# Altium schematic sheet COMS0011 Communications Footprints.SchDoc: Flatsat Communications Footprints
size A3; Engineer: A. Shaw, E.Nafis, C. Brown; DocumentNumber: COMS0011; SheetNumber: 3; SheetTotal: 6; Description: Footprints for Communication boards on Flatsat; Version: 1.0
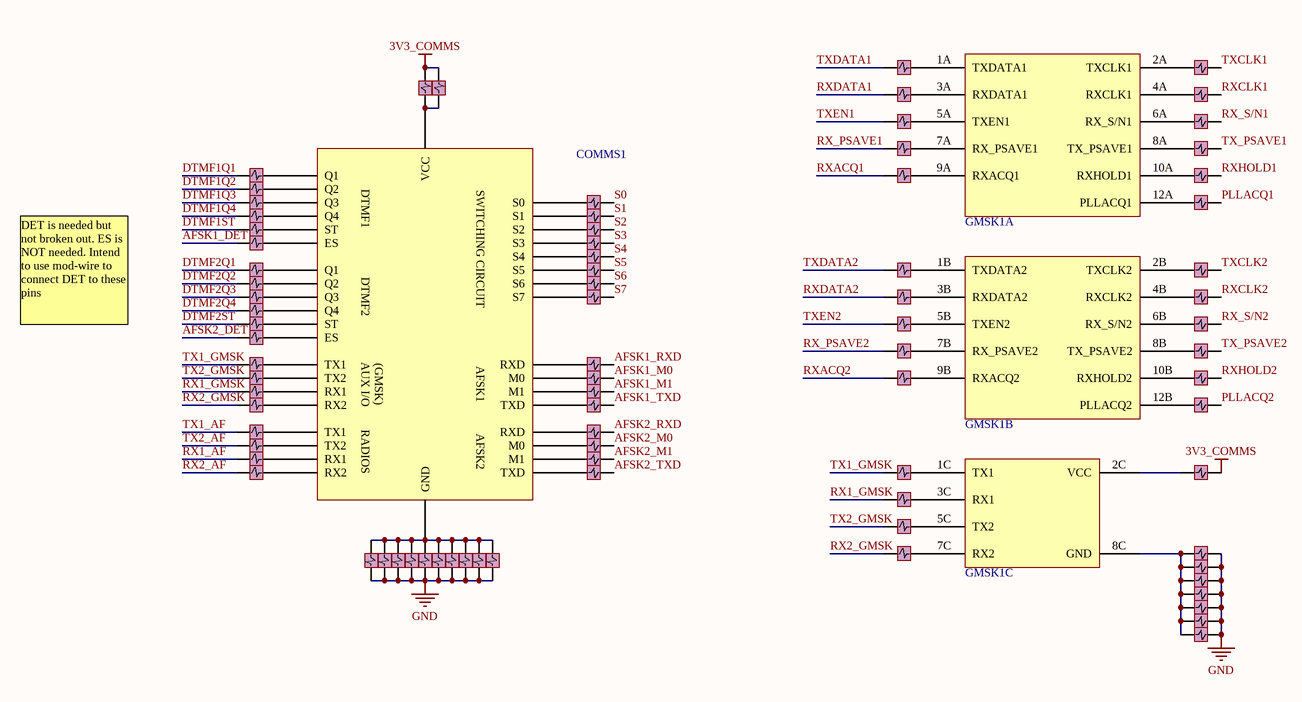
[diagram p0: COMS0011 Communications Footprints.SchDoc]

## Parts
COMMS1  COMMS  [Communications]  (value not drawn)
GMSK1  GMSK  [GMSK]  (value not drawn)  (parts A,B,C of 3)
P103  Jumper_Filter  [Jumper_filter]  (value not drawn)
P104  Jumper_Filter  [Jumper_filter]  (value not drawn)
P105  Jumper_Filter  [Jumper_filter]  (value not drawn)
P106  Jumper_Filter  [Jumper_filter]  (value not drawn)
P107  Jumper_Filter  [Jumper_filter]  (value not drawn)
P108  Jumper_Filter  [Jumper_filter]  (value not drawn)
P109  Jumper_Filter  [Jumper_filter]  (value not drawn)
P110  Jumper_Filter  [Jumper_filter]  (value not drawn)
P111  Jumper_Filter  [Jumper_filter]  (value not drawn)
P112  Jumper_Filter  [Jumper_filter]  (value not drawn)
P113  Jumper_Filter  [Jumper_filter]  (value not drawn)
P114  Jumper_Filter  [Jumper_filter]  (value not drawn)
P115  Jumper_Filter  [Jumper_filter]  (value not drawn)
P116  Jumper_Filter  [Jumper_filter]  (value not drawn)
P117  Jumper_Filter  [Jumper_filter]  (value not drawn)
P118  Jumper_Filter  [Jumper_filter]  (value not drawn)
P119  Jumper_Filter  [Jumper_filter]  (value not drawn)
P120  Jumper_Filter  [Jumper_filter]  (value not drawn)
P121  Jumper_Filter  [Jumper_filter]  (value not drawn)
P122  Jumper_Filter  [Jumper_filter]  (value not drawn)
P123  Jumper_Filter  [Jumper_filter]  (value not drawn)
P124  Jumper_Filter  [Jumper_filter]  (value not drawn)
P125  Jumper_Filter  [Jumper_filter]  (value not drawn)
P126  Jumper_Filter  [Jumper_filter]  (value not drawn)
P127  Jumper_Filter  [Jumper_filter]  (value not drawn)
P128  Jumper_Filter  [Jumper_filter]  (value not drawn)
P129  Jumper_Filter  [Jumper_filter]  (value not drawn)
P130  Jumper_Filter  [Jumper_filter]  (value not drawn)
P131  Jumper_Filter  [Jumper_filter]  (value not drawn)
P132  Jumper_Filter  [Jumper_filter]  (value not drawn)
P133  Jumper_Filter  [Jumper_filter]  (value not drawn)
P134  Jumper_Filter  [Jumper_filter]  (value not drawn)
P135  Jumper_Filter  [Jumper_filter]  (value not drawn)
P136  Jumper_Filter  [Jumper_filter]  (value not drawn)
P137  Jumper_Filter  [Jumper_filter]  (value not drawn)
P138  Jumper_Filter  [Jumper_filter]  (value not drawn)
P139  Jumper_Filter  [Jumper_filter]  (value not drawn)
P140  Jumper_Filter  [Jumper_filter]  (value not drawn)
P141  Jumper_Filter  [Jumper_filter]  (value not drawn)
P142  Jumper_Filter  [Jumper_filter]  (value not drawn)
P143  Jumper_Filter  [Jumper_filter]  (value not drawn)
P144  Jumper_Filter  [Jumper_filter]  (value not drawn)
P145  Jumper_Filter  [Jumper_filter]  (value not drawn)
P146  Jumper_Filter  [Jumper_filter]  (value not drawn)
P147  Jumper_Filter  [Jumper_filter]  (value not drawn)
P148  Jumper_Filter  [Jumper_filter]  (value not drawn)
P149  Jumper_Filter  [Jumper_filter]  (value not drawn)
P150  Jumper_Filter  [Jumper_filter]  (value not drawn)
P151  Jumper_Filter  [Jumper_filter]  (value not drawn)
P152  Jumper_Filter  [Jumper_filter]  (value not drawn)
P153  Jumper_Filter  [Jumper_filter]  (value not drawn)
P154  Jumper_Filter  [Jumper_filter]  (value not drawn)
P155  Jumper_Filter  [Jumper_filter]  (value not drawn)
P156  Jumper_Filter  [Jumper_filter]  (value not drawn)
P157  Jumper_Filter  [Jumper_filter]  (value not drawn)
P158  Jumper_Filter  [Jumper_filter]  (value not drawn)
P159  Jumper_Filter  [Jumper_filter]  (value not drawn)
P160  Jumper_Filter  [Jumper_filter]  (value not drawn)
P161  Jumper_Filter  [Jumper_filter]  (value not drawn)
P162  Jumper_Filter  [Jumper_filter]  (value not drawn)
P163  Jumper_Filter  [Jumper_filter]  (value not drawn)
P164  Jumper_Filter  [Jumper_filter]  (value not drawn)
P165  Jumper_Filter  [Jumper_filter]  (value not drawn)
P166  Jumper_Filter  [Jumper_filter]  (value not drawn)
P167  Jumper_Filter  [Jumper_filter]  (value not drawn)
P168  Jumper_Filter  [Jumper_filter]  (value not drawn)
P169  Jumper_Filter  [Jumper_filter]  (value not drawn)
P170  Jumper_Filter  [Jumper_filter]  (value not drawn)
P171  Jumper_Filter  [Jumper_filter]  (value not drawn)
P172  Jumper_Filter  [Jumper_filter]  (value not drawn)
P173  Jumper_Filter  [Jumper_filter]  (value not drawn)
P174  Jumper_Filter  [Jumper_filter]  (value not drawn)
P175  Jumper_Filter  [Jumper_filter]  (value not drawn)
P176  Jumper_Filter  [Jumper_filter]  (value not drawn)
P177  Jumper_Filter  [Jumper_filter]  (value not drawn)
P178  Jumper_Filter  [Jumper_filter]  (value not drawn)
P179  Jumper_Filter  [Jumper_filter]  (value not drawn)
P180  Jumper_Filter  [Jumper_filter]  (value not drawn)
P181  Jumper_Filter  [Jumper_filter]  (value not drawn)
P182  Jumper_Filter  [Jumper_filter]  (value not drawn)
P183  Jumper_Filter  [Jumper_filter]  (value not drawn)
P184  Jumper_Filter  [Jumper_filter]  (value not drawn)

## Nets
3V3_COMMS: P127.1 P129.1 P177.1
GND: P103.3 P104.3 P105.3 P106.3 P107.3 P108.3 P109.3 P110.3 P111.3 P112.3 P113.3 P114.3 P115.3 P116.3 P117.3 P118.3 P119.3 P120.3 P121.3 P122.3 P123.1 P123.3 P124.1 P124.3 P125.1 P125.3 P126.1 P126.3 P127.3 P128.1 P128.3 P129.3 P130.1 P130.3 P131.1 P131.3 P132.1 P132.3 P133.1 P133.3 P134.1 P134.3 P135.3 P136.3 P137.3 P138.3 P139.3 P140.3 P141.3 P142.3 P143.3 P144.3 P145.3 P146.3 P147.3 P148.3 P149.3 P150.3 P151.3 P152.3 P153.3 P154.3 P155.3 P156.3 P157.3 P158.3 P159.3 P160.3 P161.3 P162.3 P163.3 P164.3 P165.3 P166.3 P167.3 P168.3 P169.3 P170.3 P171.3 P172.3 P173.3 P174.3 P175.3 P176.3 P177.3 P178.1 P178.3 P179.1 P179.3 P180.1 P180.3 P181.1 P181.3 P182.1 P182.3 P183.1 P183.3 P184.1 P184.3
AFSK1_DET: P108.1
AFSK1_M0: P144.1
AFSK1_M1: P145.1
AFSK1_RXD: P143.1
AFSK1_TXD: P146.1
AFSK2_DET: P114.1
AFSK2_M0: P148.1
AFSK2_M1: P149.1
AFSK2_RXD: P147.1
AFSK2_TXD: P150.1
DTMF1Q1: P103.1
DTMF1Q2: P104.1
DTMF1Q3: P105.1
DTMF1Q4: P106.1
DTMF1ST: P107.1
DTMF2Q1: P109.1
DTMF2Q2: P110.1
DTMF2Q3: P111.1
DTMF2Q4: P112.1
DTMF2ST: P113.1
PLLACQ1: P170.1
PLLACQ2: P176.1
RX1_AF: P121.1
RX1_GMSK: P117.1 P162.1
RX2_AF: P122.1
RX2_GMSK: P118.1 P164.1
RX_PSAVE1: P154.1
RX_PSAVE2: P159.1
RX_S/N1: P167.1
RX_S/N2: P173.1
RXACQ1: P155.1
RXACQ2: P160.1
RXCLK1: P166.1
RXCLK2: P172.1
RXDATA1: P152.1
RXDATA2: P157.1
RXHOLD1: P169.1
RXHOLD2: P175.1
S0: P135.1
S1: P136.1
S2: P137.1
S3: P138.1
S4: P139.1
S5: P140.1
S6: P141.1
S7: P142.1
TX1_AF: P119.1
TX1_GMSK: P115.1 P161.1
TX2_AF: P120.1
TX2_GMSK: P116.1 P163.1
TX_PSAVE1: P168.1
TX_PSAVE2: P174.1
TXCLK1: P165.1
TXCLK2: P171.1
TXDATA1: P151.1
TXDATA2: P156.1
TXEN1: P153.1
TXEN2: P158.1
NetCOMMS1_AFSK1_M0: COMMS1.AFSK1_M0(M0) P144.2
NetCOMMS1_AFSK1_M1: COMMS1.AFSK1_M1(M1) P145.2
NetCOMMS1_AFSK1_RXD: COMMS1.AFSK1_RXD(RXD) P143.2
NetCOMMS1_AFSK1_TXD: COMMS1.AFSK1_TXD(TXD) P146.2
NetCOMMS1_AFSK2_M0: COMMS1.AFSK2_M0(M0) P148.2
NetCOMMS1_AFSK2_M1: COMMS1.AFSK2_M1(M1) P149.2
NetCOMMS1_AFSK2_RXD: COMMS1.AFSK2_RXD(RXD) P147.2
NetCOMMS1_AFSK2_TXD: COMMS1.AFSK2_TXD(TXD) P150.2
NetCOMMS1_DTMF1_ES: COMMS1.DTMF1_ES(ES) P108.2
NetCOMMS1_DTMF1_Q1: COMMS1.DTMF1_Q1(Q1) P103.2
NetCOMMS1_DTMF1_Q2: COMMS1.DTMF1_Q2(Q2) P104.2
NetCOMMS1_DTMF1_Q3: COMMS1.DTMF1_Q3(Q3) P105.2
NetCOMMS1_DTMF1_Q4: COMMS1.DTMF1_Q4(Q4) P106.2
NetCOMMS1_DTMF1_ST: COMMS1.DTMF1_ST(ST) P107.2
NetCOMMS1_DTMF2_ES: COMMS1.DTMF2_ES(ES) P114.2
NetCOMMS1_DTMF2_Q1: COMMS1.DTMF2_Q1(Q1) P109.2
NetCOMMS1_DTMF2_Q2: COMMS1.DTMF2_Q2(Q2) P110.2
NetCOMMS1_DTMF2_Q3: COMMS1.DTMF2_Q3(Q3) P111.2
NetCOMMS1_DTMF2_Q4: COMMS1.DTMF2_Q4(Q4) P112.2
NetCOMMS1_DTMF2_ST: COMMS1.DTMF2_ST(ST) P113.2
NetCOMMS1_GMSK_RX1: COMMS1.GMSK_RX1(RX1) P117.2
NetCOMMS1_GMSK_RX2: COMMS1.GMSK_RX2(RX2) P118.2
NetCOMMS1_GMSK_TX1: COMMS1.GMSK_TX1(TX1) P115.2
NetCOMMS1_GMSK_TX2: COMMS1.GMSK_TX2(TX2) P116.2
NetCOMMS1_GND: COMMS1.GND P123.2 P124.2 P125.2 P126.2 P128.2 P130.2 P131.2 P132.2 P133.2 P134.2
NetCOMMS1_RX1: COMMS1.RX1 P121.2
NetCOMMS1_RX2: COMMS1.RX2 P122.2
NetCOMMS1_S0: COMMS1.S0 P135.2
NetCOMMS1_S1: COMMS1.S1 P136.2
NetCOMMS1_S2: COMMS1.S2 P137.2
NetCOMMS1_S3: COMMS1.S3 P138.2
NetCOMMS1_S4: COMMS1.S4 P139.2
NetCOMMS1_S5: COMMS1.S5 P140.2
NetCOMMS1_S6: COMMS1.S6 P141.2
NetCOMMS1_S7: COMMS1.S7 P142.2
NetCOMMS1_TX1: COMMS1.TX1 P119.2
NetCOMMS1_TX2: COMMS1.TX2 P120.2
NetCOMMS1_VCC: COMMS1.VCC P127.2 P129.2
NetGMSK1_1A: GMSK1.1A(TXDATA1) P151.2
NetGMSK1_1B: GMSK1.1B(TXDATA2) P156.2
NetGMSK1_1C: GMSK1.1C(TX1) P161.2
NetGMSK1_2A: GMSK1.2A(TXCLK1) P165.2
NetGMSK1_2B: GMSK1.2B(TXCLK2) P171.2
NetGMSK1_2C: GMSK1.2C(VCC) P177.2
NetGMSK1_3A: GMSK1.3A(RXDATA1) P152.2
NetGMSK1_3B: GMSK1.3B(RXDATA2) P157.2
NetGMSK1_3C: GMSK1.3C(RX1) P162.2
NetGMSK1_4A: GMSK1.4A(RXCLK1) P166.2
NetGMSK1_4B: GMSK1.4B(RXCLK2) P172.2
NetGMSK1_5A: GMSK1.5A(TXEN1) P153.2
NetGMSK1_5B: GMSK1.5B(TXEN2) P158.2
NetGMSK1_5C: GMSK1.5C(TX2) P163.2
NetGMSK1_6A: GMSK1.6A(RX_S/N1) P167.2
NetGMSK1_6B: GMSK1.6B(RX_S/N2) P173.2
NetGMSK1_7A: GMSK1.7A(RX_PSAVE1) P154.2
NetGMSK1_7B: GMSK1.7B(RX_PSAVE2) P159.2
NetGMSK1_7C: GMSK1.7C(RX2) P164.2
NetGMSK1_8A: GMSK1.8A(TX_PSAVE1) P168.2
NetGMSK1_8B: GMSK1.8B(TX_PSAVE2) P174.2
NetGMSK1_8C: GMSK1.8C(GND) P178.2 P179.2 P180.2 P181.2 P182.2 P183.2 P184.2
NetGMSK1_9A: GMSK1.9A(RXACQ1) P155.2
NetGMSK1_9B: GMSK1.9B(RXACQ2) P160.2
NetGMSK1_10A: GMSK1.10A(RXHOLD1) P169.2
NetGMSK1_10B: GMSK1.10B(RXHOLD2) P175.2
NetGMSK1_12A: GMSK1.12A(PLLACQ1) P170.2
NetGMSK1_12B: GMSK1.12B(PLLACQ2) P176.2

## Notes on the sheet
- DET is needed but not broken out. ES is NOT needed. Intend to use mod-wire to connect DET to these pins
- Title
- Description:
- Size:
- Author:
- Date:
- A3
- Time:
- Version
- Sheet:
- Drawing No.:
- of
- File:
- (in symbol COMMS) DTMF1; SWITCHING CIRCUIT; DTMF2; AUX I/O; (GMSK); AFSK1; RADIOS; AFSK2

## Library data of the parts
COMMS1 = COMMS: ClassName: COMMSB
GMSK1 = GMSK: ClassName: GMSK
P103-P184 = Jumper_Filter
  P103-P150: ClassName: COMMSB
  P151-P184: ClassName: GMSK